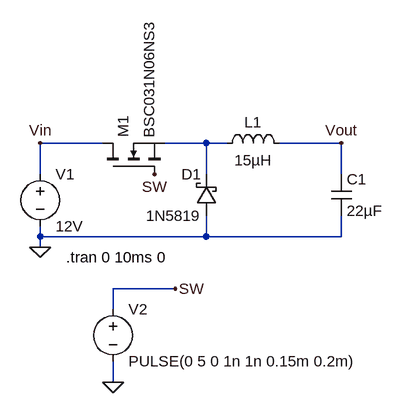
[diagram p0: schematic Buck_Converter.asc]
Buck_Converter.asc, the LTspice schematic file:
Version 4
SHEET 1 880 680
WIRE -96 80 -192 80
WIRE 64 80 0 80
WIRE 96 80 64 80
WIRE 272 80 176 80
WIRE -192 128 -192 80
WIRE 64 128 64 80
WIRE 272 128 272 80
WIRE -192 224 -192 208
WIRE 64 224 64 192
WIRE 64 224 -192 224
WIRE 272 224 272 192
WIRE 272 224 64 224
WIRE -192 240 -192 224
WIRE 16 304 -80 304
WIRE -80 336 -80 304
WIRE -80 448 -80 416
FLAG -192 240 0
FLAG -16 128 SW
FLAG -80 448 0
FLAG -192 80 Vin
FLAG 272 80 Vout
FLAG 16 304 SW
SYMBOL voltage -192 112 R0
WINDOW 123 0 0 Left 0
WINDOW 39 0 0 Left 0
SYMATTR InstName V1
SYMATTR Value 12V
SYMBOL nmos -96 128 R270
SYMATTR InstName M1
SYMATTR Value BSC031N06NS3
SYMBOL ind 80 96 R270
WINDOW 0 32 56 VTop 2
WINDOW 3 5 56 VBottom 2
SYMATTR InstName L1
SYMATTR Value 15µH
SYMBOL cap 256 128 R0
SYMATTR InstName C1
SYMATTR Value 22µF
SYMBOL schottky 80 192 R180
WINDOW 0 24 64 Left 2
WINDOW 3 24 0 Left 2
SYMATTR InstName D1
SYMATTR Value 1N5819
SYMATTR Description Diode
SYMATTR Type diode
SYMBOL voltage -80 320 R0
WINDOW 123 0 0 Left 0
WINDOW 39 0 0 Left 0
SYMATTR InstName V2
SYMATTR Value PULSE(0 5 0 1n 1n 0.15m 0.2m)
TEXT -152 256 Left 2 !.tran 0 10ms 0

The netlist it stands for:
* Buck_Converter.asc
V1 Vin 0 12V
M1 Vin SW N001 N001 BSC031N06NS3
L1 N001 Vout 15µH
C1 Vout 0 22µF
D1 0 N001 1N5819
V2 SW 0 PULSE(0 5 0 1n 1n 0.15m 0.2m)
.model D D
.lib standard.dio
.model NMOS NMOS
.model PMOS PMOS
.lib standard.mos
.tran 0 10ms 0
.backanno
.end